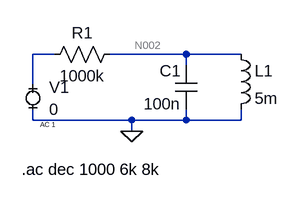
[diagram p0: schematic Draft3.asc]
Draft3.asc, the LTspice schematic file:
Version 4
SHEET 1 880 680
WIRE 48 144 16 144
WIRE 240 144 128 144
WIRE 320 144 240 144
WIRE 240 160 240 144
WIRE 16 192 16 144
WIRE 16 240 16 224
WIRE 160 240 16 240
WIRE 240 240 240 224
WIRE 240 240 160 240
WIRE 320 240 320 224
WIRE 320 240 240 240
WIRE 160 256 160 240
FLAG 160 256 0
SYMBOL MiniSyms4\\voltage- 16 208 R0
WINDOW 123 11 39 Left 0
WINDOW 39 0 0 Left 0
SYMATTR Value2 AC 1
SYMATTR InstName V1
SYMATTR Value 0
SYMBOL res 144 128 R90
WINDOW 0 0 56 VBottom 2
WINDOW 3 32 56 VTop 2
SYMATTR InstName R1
SYMATTR Value 1000k
SYMBOL ind 304 128 R0
SYMATTR InstName L1
SYMATTR Value 5m
SYMBOL cap 256 224 R180
WINDOW 0 24 56 Left 2
WINDOW 3 24 8 Left 2
SYMATTR InstName C1
SYMATTR Value 100n
TEXT 0 312 Left 2 !.ac dec 1000 6k 8k

The netlist it stands for:
* Draft3.asc
V1 N001 0 0 AC 1
R1 N002 N001 1000k
L1 N002 0 5m
C1 0 N002 100n
.ac dec 1000 6k 8k
.backanno
.end

* Results of the author's LTspice run, read from the files saved beside the schematic
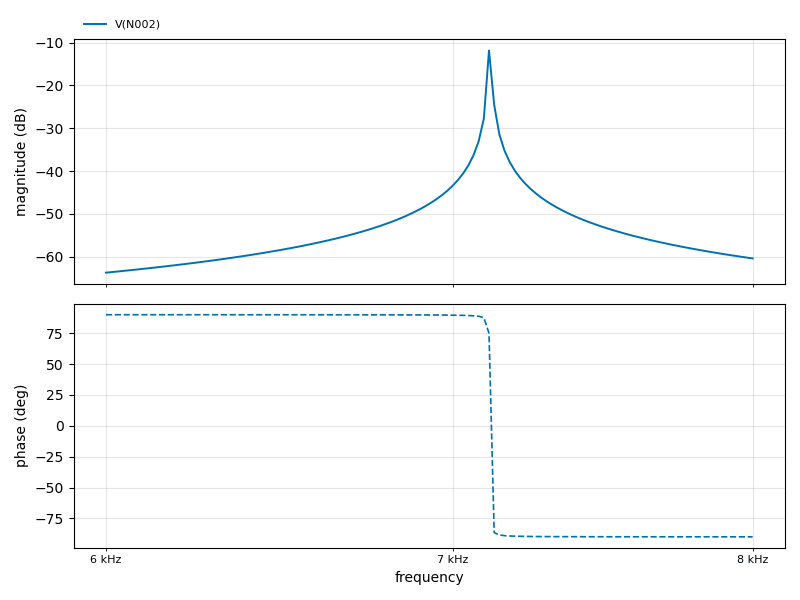
[diagram p1: AC Analysis of Draft3.asc, plotted from the saved traces]
* AC Analysis, 1 run:
*   V(N002): -63.72 dB at 6 kHz, -60.40 dB at 8 kHz, peak -11.87 dB at 7.115 kHz, 3 dB below the peak at 7.112 kHz and 7.119 kHz